# EAGLE design TXS0108 Breakout (EAGLE 9.6.2)
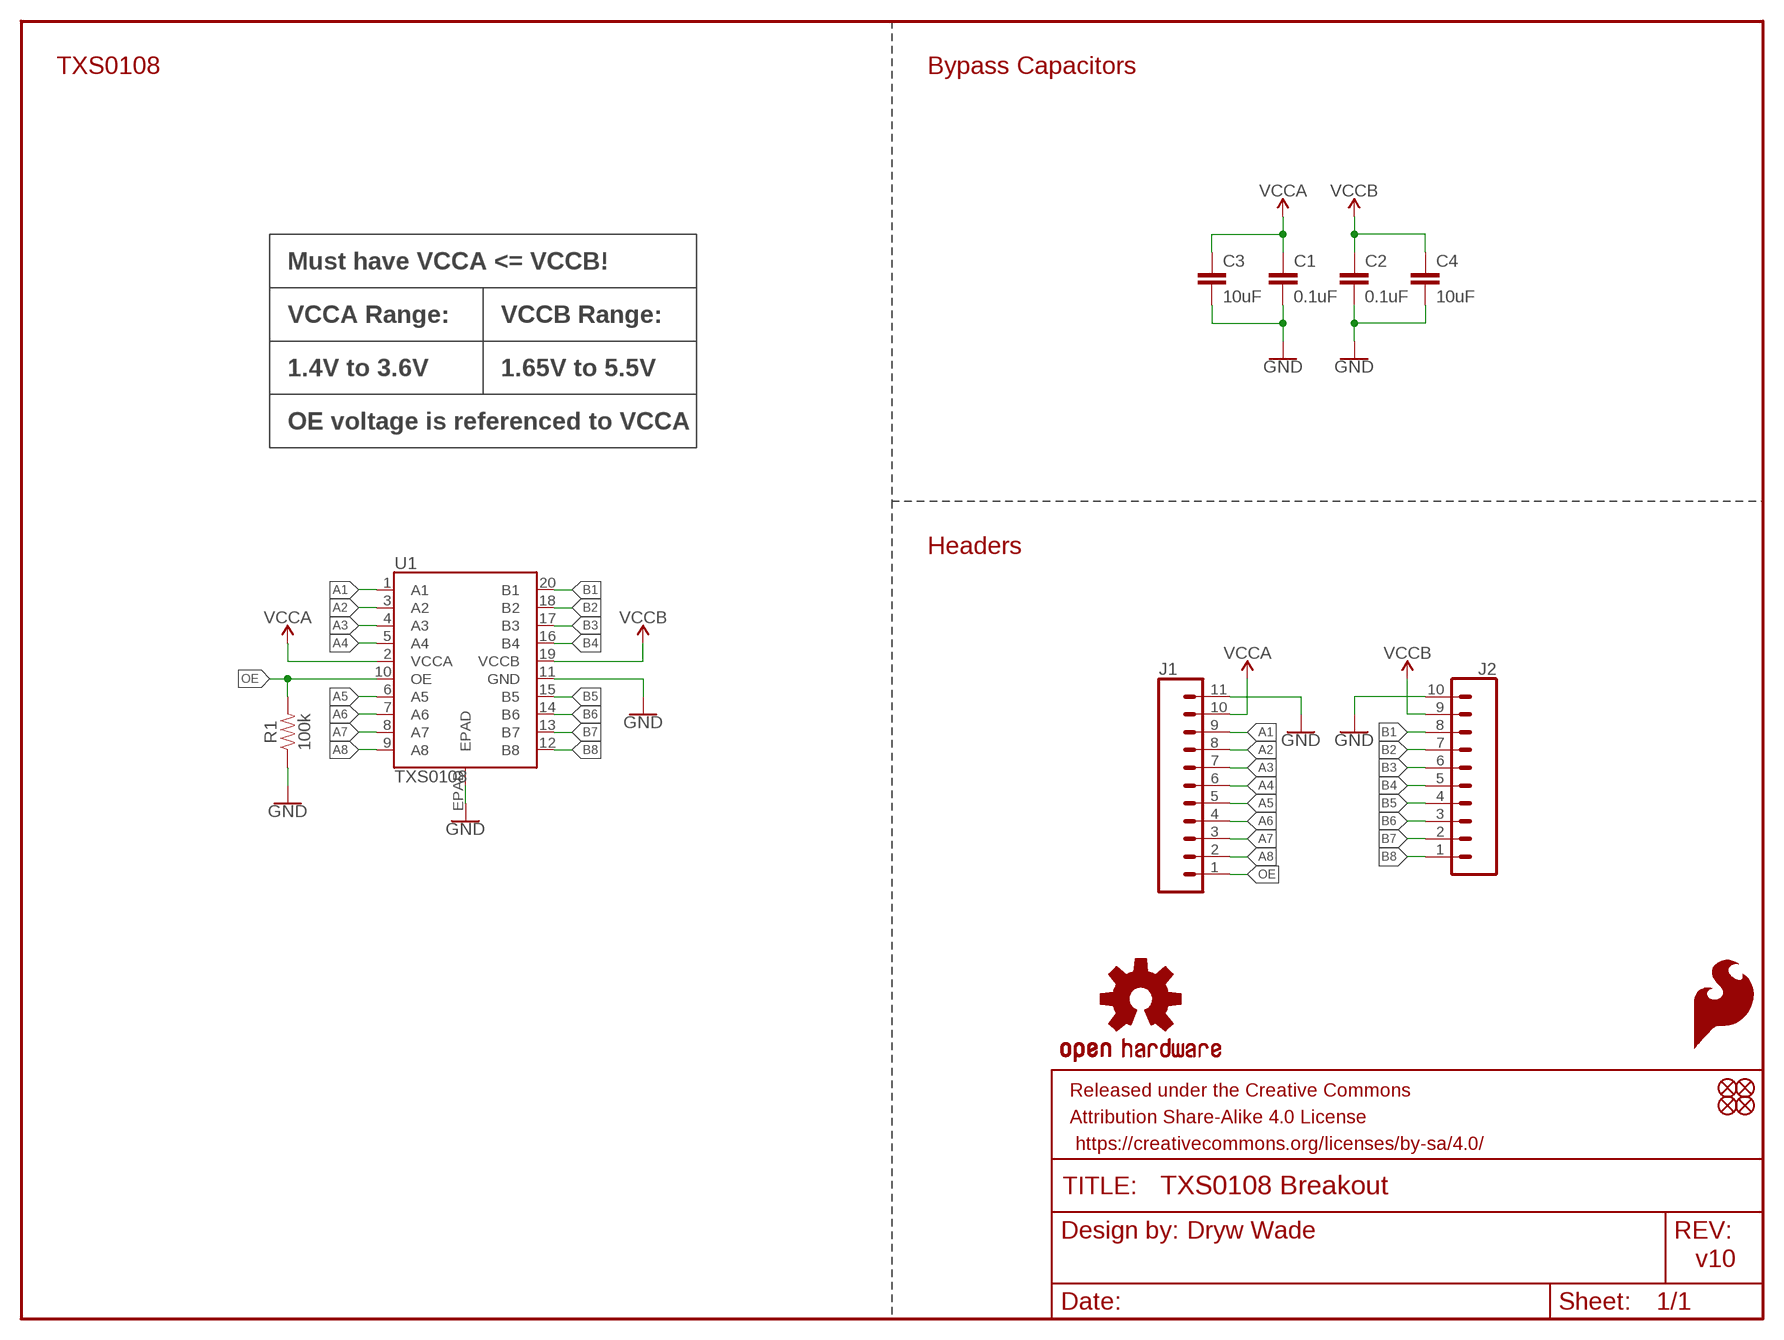
[diagram p0: schematic, sheet 1]

## Parts
C1  0.1uF  0.1UF-0603-25V-(+80/-20%)  [0603]
C2  0.1uF  0.1UF-0603-25V-(+80/-20%)  [0603]
C3  10uF  10UF-0603-6.3V-20%  [0603]
C4  10uF  10UF-0603-6.3V-20%  [0603]
FD1  FIDUCIAL1X2  [FIDUCIAL-1X2]
FD2  FIDUCIAL1X2  [FIDUCIAL-1X2]
FD3  FIDUCIAL1X2  [FIDUCIAL-1X2]
FD4  FIDUCIAL1X2  [FIDUCIAL-1X2]
FRAME1  FRAME-LETTER  [CREATIVE_COMMONS]
J1  CONN_111X11_NO_SILK  [1X11_NO_SILK]
J2  CONN_10NO_SILK_PTH_FEMALE  [1X10_NO_SILK]
LOGO1  OSHW-LOGOS  [OSHW-LOGO-S]
LOGO2  SFE_LOGO_FLAME.1_INCH  [SFE_LOGO_FLAME_.1]
R1  100k  100KOHM-0603-1/10W-1%  [0603]
U1  TXS0108  TXS0108-VFQFN_20  [VFQFN-20]

## Nets
A1: J1.9 U1.1(A1)
A2: J1.8 U1.3(A2)
A3: J1.7 U1.4(A3)
A4: J1.6 U1.5(A4)
A5: J1.5 U1.6(A5)
A6: J1.4 U1.7(A6)
A7: J1.3 U1.8(A7)
A8: J1.2 U1.9(A8)
B1: J2.8 U1.20(B1)
B2: J2.7 U1.18(B2)
B3: J2.6 U1.17(B3)
B4: J2.5 U1.16(B4)
B5: J2.4 U1.15(B5)
B6: J2.3 U1.14(B6)
B7: J2.2 U1.13(B7)
B8: J2.1 U1.12(B8)
GND: C1.2 C2.2 C3.2 C4.2 J1.11 J2.10 R1.1 U1.11(GND) U1.EPAD
OE: J1.1 R1.2 U1.10(OE)
VCCA: C1.1 C3.1 J1.10 U1.2(VCCA)
VCCB: C2.1 C4.1 J2.9 U1.19(VCCB)

## Notes on the sheet
- TXS0108 | Bypass Capacitors
- Must have VCCA <= VCCB!
- VCCA Range: | VCCB Range:
- 1.4V to 3.6V | 1.65V to 5.5V
- OE voltage is referenced to VCCA
- Headers
- Dryw Wade
- v10

## Library data of the parts
C1 C2 = SparkFun-Capacitors:0.1UF: 0.1µF ceramic capacitors A capacitor is a passive two-terminal electrical component used to store electrical energy temporarily in an electric field.; PROD_ID: CAP-00810
C3 C4 = SparkFun-Capacitors:10UF: 10.0µF ceramic capacitors A capacitor is a passive two-terminal electrical component used to store electrical energy temporarily in an electric field.; PROD_ID: CAP-11015
FD1-FD4 = SparkFun-Aesthetics:FIDUCIAL: Fiducial Alignment Points Point-of-reference for pick-and-place machines and other optical instruments.
FRAME1 = SparkFun-Aesthetics:FRAME-LETTER: Schematic Frame - Letter Standard 8.5x11 US Letter frame
J1 = SparkFun-Connectors:CONN_11: Multi connection point. Often used as Generic Header-pin footprint for 0.1 inch spaced/style header connections On any of the 0.1 inch spaced packages, you can populate with these: Break Away Headers - Straight <https://www.sparkfun.com/products/116> (PRT-00116) Break Away Male Headers - Right Angle <https://www.sparkfun.com/products/553> (PRT-00553) Female Headers <https://www.sparkfun.com/products/115> (PRT-00115) Break Away Headers - Machine Pin <https://www.sparkfun.com/products/117> (PRT-00117) Break Away Female Headers - Swiss Machine Pin <https://www.sparkfun.com/products/743> (PRT-00743) For SCREWTERMINALS and SPRING TERMINALS visit here: Screw Terimnals on SparkFun.com <https://www.sparkfun.com/search/results?term=Screw+Terminals> (5mm/3.5mm/2.54mm spacing) This device is also useful as a general connection point to wire up your design to another part of your project. Our various solder wires solder well into these plated through hole pads. Hook-Up Wire - Assortment (Stranded, 22 AWG) <https://www.sparkfun.com/products/11375> (PRT-11375) Hook-Up Wire - Assortment (Solid Core, 22 AWG) <https://www.sparkfun.com/products/11367> (PRT-11367) View the entire wire category on our website here <https://www.sparkfun.com/categories/141>
J2 = SparkFun-Connectors:CONN_10: Multi connection point. Often used as Generic Header-pin footprint for 0.1 inch spaced/style header connections On any of the 0.1 inch spaced packages, you can populate with these: Break Away Headers - Straight <https://www.sparkfun.com/products/116> (PRT-00116) Break Away Male Headers - Right Angle <https://www.sparkfun.com/products/553> (PRT-00553) Female Headers <https://www.sparkfun.com/products/115> (PRT-00115) Break Away Headers - Machine Pin <https://www.sparkfun.com/products/117> (PRT-00117) Break Away Female Headers - Swiss Machine Pin <https://www.sparkfun.com/products/743> (PRT-00743) Arduino Stackable Header - 10 Pin <https://www.sparkfun.com/products/11376> (PRT-11376) For SCREWTERMINALS and SPRING TERMINALS visit here: Screw Terimnals on SparkFun.com <https://www.sparkfun.com/search/results?term=Screw+Terminals> (5mm/3.5mm/2.54mm spacing) This device is also useful as a general connection point to wire up your design to another part of your project. Our various solder wires solder well into these plated through hole pads. Hook-Up Wire - Assortment (Stranded, 22 AWG) <https://www.sparkfun.com/products/11375> (PRT-11375) Hook-Up Wire - Assortment (Solid Core, 22 AWG) <https://www.sparkfun.com/products/11367> (PRT-11367) View the entire wire category on our website here <https://www.sparkfun.com/categories/141> Special notes: Molex polarized connector foot print use with SKU : PRT-08231 with associated crimp pins and housings. 1MM SMD Version SKU: PRT-10208 NOTES ON THE VARIANTS LOCK and LOCK_LONGPADS... This footprint was designed to help hold the alignment of a through-hole component (i.e. 6-pin header) while soldering it into place. You may notice that each hole has been shifted either up or down by 0.005 of an inch from it's more standard position (which is a perfectly straight line). This slight alteration caused the pins (the squares in the middle) to touch the edges of the holes. Because they are alternating, it causes a "brace" to hold the component in place. 0.005 has proven to be the perfect amount of "off-center" position when using our standard breakaway headers. Although looks a little odd when you look at the bare footprint, once you have a header in there, the alteration is very hard to notice. Also,if you push a header all the way into place, it is covered up entirely on the bottom side.
LOGO1 = SparkFun-Aesthetics:OSHW-LOGO: Open-Source Hardware (OSHW) Logo This logo indicates the piece of hardware it is found on incorporates a OSHW license and/or adheres to the definition of open source hardware found here: http://freedomdefined.org/OSHW
LOGO2 = SparkFun-Aesthetics:SFE_LOGO_FLAME: SparkFun Flame Logo This is the SparkFun flame logo. The logo on the schematic will always be the same size; the package variant is the height of the flame. Default layer for the logo on the board is tSilk.
R1 = SparkFun-Resistors:100KOHM: 100kΩ resistor A resistor is a passive two-terminal electrical component that implements electrical resistance as a circuit element. Resistors act to reduce current flow, and, at the same time, act to lower voltage levels within circuits. - Wikipedia; PROD_ID: RES-07828
U1 = SparkFun-IC-Comms:TXS0108: 8-Bit Bi-Directional Level Shifter For Open-Drain and Push-Pull 1.2V-3.6V (VCCA) to 1.65V-5.5V (VCCB) bi-directional level shifter with auto direction sensing. Max data rate - VCCA 1.2V: 20Mbps (50ns), VCCA 3.3V: 100Mbps (10ns) Digikey: 296-24806-2-ND (20-VFDFN) SparkFun Products Example Product (SKU); PROD_ID: IC-14343

## Board
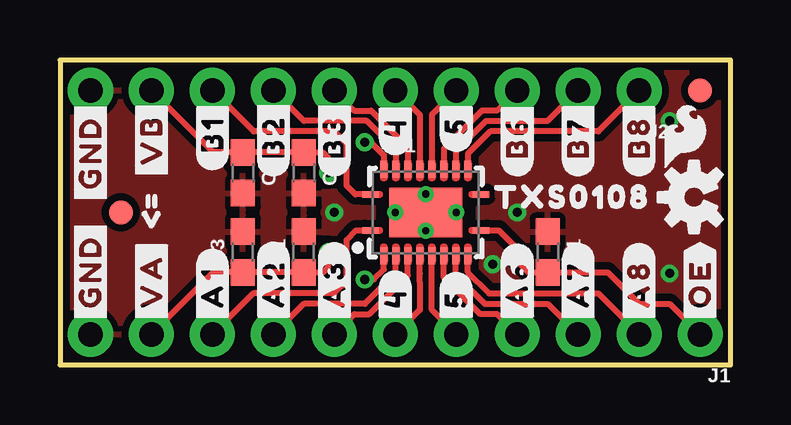
[diagram p1: board, top side]
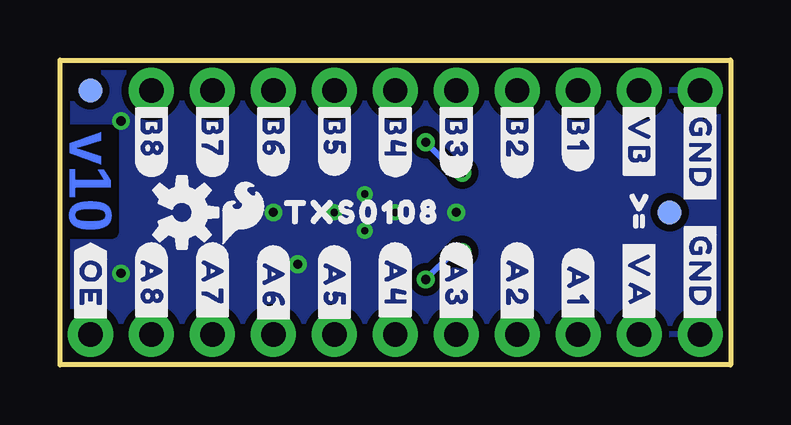
[diagram p2: board, bottom side, seen from below]

Size 27.94 x 12.7 mm. Coordinates in mm from the lower left corner, seen from the top.
Outline: 0,0 27.94,0 27.94,12.7 0,12.7 0,0
Copper layers (1*16): Top 0.035mm / dielectric 1.5mm / Bottom 0.035mm
Design rules "SparkFun-2-Layer-General-JLCPCB": minimum track width 7mil, minimum drill 0.3mm, track to track 7mil, track to pad 7mil, pad to pad 7mil, via to via 7mil, smd to smd 7mil, copper to edge 7mil, drill to drill 7mil, minimum pad ring 7mil, minimum via ring 7mil, stop-mask expansion 3mil, vias tented up to drill 25mil, thermal gap 10mil
tRestrict: area 16.9,7 to 17,7.2; area 17.3,6.9 to 17.4,6.9; area 13.5,6.1 to 13.6,6.6; area 16.9,6.1 to 17,6.6

### Footprints (pad centres in the part's own frame; a part is rotated, then mirrored left to right if it is on the bottom)
0603 = smd 1.1 x 1: 1 -0.85,0; 2 0.85,0
FIDUCIAL-1X2 = smd 1 x 1: 1 0,0
1X11_NO_SILK = drill 1.016 pad 1.88: 1 0,0; 2 2.54,0; 3 5.08,0; 4 7.62,0; 5 10.16,0; 6 12.7,0; 7 15.24,0; 8 17.78,0; 9 20.32,0; 10 22.86,0; 11 25.4,0
1X10_NO_SILK = drill 1.016 pad 1.88: 1 0,0; 2 2.54,0; 3 5.08,0; 4 7.62,0; 5 10.16,0; 6 12.7,0; 7 15.24,0; 8 17.78,0; 9 20.32,0; 10 22.86,0
VFQFN-20 = smd 0.7 x 0.28: 1 -2.3,-0.75; 10 2.3,-0.75; 11 2.3,0.75; 20 -2.3,0.75 | smd 0.28 x 0.7: 2 -1.75,-1.8; 3 -1.25,-1.8; 4 -0.75,-1.8; 5 -0.25,-1.8; 6 0.25,-1.8; 7 0.75,-1.8; 8 1.25,-1.8; 9 1.75,-1.8; 12 1.75,1.8; 13 1.25,1.8; 14 0.75,1.8; 15 0.25,1.8; 16 -0.25,1.8; 17 -0.75,1.8; 18 -1.25,1.8; 19 -1.75,1.8 | smd 3.05 x 2.05: EPAD 0,0

### Placement (x,y rotation side)
C1  10.16,4.7 90 top
C2  10.16,8 270 top
C3  7.62,4.7 90 top
C4  7.62,8 270 top
FD1  26.67,11.43 0 top
FD2  26.67,11.43 0 bottom
FD3  2.54,6.35 0 top
FD4  2.54,6.35 0 bottom
FRAME1  -11.43,-8.89 0 top  (outside the outline)
J1  26.67,1.27 180 top
J2  24.13,11.43 180 top
LOGO1  26.42,6.99 90 top
LOGO2  26.04,9.53 0 top
LOGO3  SFE_LOGO_FLAME.1_INCH  [SFE_LOGO_FLAME_.1]  20.32,6.35 0 bottom
LOGO4  OSHW-LOGOS  [OSHW-LOGO-S]  22.86,6.35 270 bottom
R1  20.32,4.7 270 top
U1  15.24,6.35 0 top
U$1  [#GND#0]  1.27,6.6 90 top
U$2  [#GND#0]  1.27,1.65 90 top
U$3  [#VA#0]  3.81,1.65 90 top
U$4  [#VA#0]  3.81,5.33 270 bottom
U$5  [#A1#0]  6.35,1.65 90 top
U$6  [#A2#0]  8.89,1.65 90 top
U$7  [#A3#0]  11.43,1.65 90 top
U$8  [#4#0]  13.97,1.65 90 top
U$9  [#5#0]  16.51,1.65 90 top
U$10  [#A6#0]  19.05,1.65 90 top
U$11  [#A7#0]  21.59,1.65 90 top
U$12  [#A8#0]  24.13,1.65 90 top
U$13  [#B8#0]  24.13,7.87 90 top
U$14  [#B7#0]  21.59,7.87 90 top
U$15  [#B6#0]  19.05,7.87 90 top
U$16  [#4#6]  13.97,8.76 90 top
U$17  [#5#6]  16.51,8.89 90 top
U$18  [#B3#0]  11.43,7.87 90 top
U$19  [#B2#0]  8.89,7.87 90 top
U$20  [#B1#0]  6.35,8.13 90 top
U$21  [#OE#0]  26.67,1.65 90 top
U$22  [#VB#0]  3.81,7.62 90 top
U$23  [#VB#0]  3.81,11.05 270 bottom
U$24  [#A1#2]  6.35,4.83 270 bottom
U$25  [#A2#2]  8.89,5.08 270 bottom
U$26  [#A3#3]  11.43,5.08 270 bottom
U$27  [#A4#4]  13.97,5.08 270 bottom
U$28  [#A5#5]  16.51,4.95 270 bottom
U$29  [#A6#6]  19.05,4.95 270 bottom
U$30  [#A7#8]  21.59,5.08 270 bottom
U$31  [#A8#9]  24.13,5.08 270 bottom
U$32  [#GND#0]  1.27,11.05 270 bottom
U$33  [#0]  3.81,6.88 90 top
U$34  [#GND#0]  1.27,6.1 270 bottom
U$35  [#B8#9]  24.13,11.05 270 bottom
U$36  [#B7#9]  21.59,11.05 270 bottom
U$37  [#B6#9]  19.05,11.05 270 bottom
U$38  [#B5#9]  16.51,11.05 270 bottom
U$39  [#B4#9]  13.97,11.05 270 bottom
U$40  [#B3#9]  11.43,11.05 270 bottom
U$41  [#B2#9]  8.89,11.05 270 bottom
U$42  [#B1#9]  6.35,11.05 270 bottom
U$43  [TXS01080]  19.3,6.35 0 bottom
U$44  [TXS01080]  17.4,6.99 0 top
U$45  [#OE#1]  26.67,5.08 270 bottom
U$46  [V0]  3.89,6.17 0 top
U$47  [#0]  3.81,6.05 90 bottom
U$48  [V0]  3.73,6.88 0 bottom

### Tracks (layer width: path | path; a pad name or v marks a point on that pad's centre or on a via)
A1
  Top 0.254: U1.1 12.33,5.6 11.94,5.21 11.94,3.48 11.43,2.97 8.05,2.97 J1.9
A2
  Top 0.254: U1.3 13.99,3.83 12.7,2.54 10.16,2.54 J1.8
A3
  Top 0.254: J1.7 12.27,2.11 12.88,2.11 14.49,3.72 U1.4
A4
  Top 0.254: U1.5 14.99,3.81 14.99,3.43 14.99,2.29 J1.6
A5
  Top 0.254: J1.5 15.49,2.29 U1.6
A6
  Top 0.254: J1.4 18.21,2.11 17.52,2.11 15.99,3.64 U1.7
A7
  Top 0.254: U1.8 16.49,3.75 17.7,2.54 20.32,2.54 J1.3
A8
  Top 0.254: U1.9 16.99,3.86 17.88,2.97 22.43,2.97 J1.2
B1
  Top 0.254: J2.8 6.37,11.43 8.07,9.73 11.43,9.73 11.94,9.22 11.94,7.47 12.3,7.1 U1.20
B2
  Top 0.254: U1.18 13.99,8.95 12.78,10.16 10.16,10.16 J2.7
B3
  Top 0.254: J2.6 12.27,10.59 12.96,10.59 14.49,9.06 U1.17
B4
  Top 0.254: J2.5 14.99,10.41 U1.16
B5
  Top 0.254: J2.4 15.49,10.41 U1.15
B6
  Top 0.254: J2.3 18.21,10.59 17.57,10.59 15.99,9.01 U1.14
B7
  Top 0.254: U1.13 16.49,8.9 17.75,10.16 20.32,10.16 J2.2
B8
  Top 0.254: U1.12 16.99,8.79 17.93,9.73 22.43,9.73 J2.1
GND  (via drill 0.3 pad 0.25, 0.38, 0.38 pad 0.25)
  other vias: 11.43,6.35 19.05,6.35 25.4,10.16 25.4,3.81 16.51,6.35 13.97,6.35 15.24,5.59 15.24,7.11 18.03,4.19
  pour Top (isolate 0.305): 0,0 27.94,0 27.94,12.7 0,12.7
  pour Bottom (isolate 0.305): 0,0 27.94,0 27.94,12.7 0,12.7
OE
  Top 0.254: U1.10 18.28,5.6 19.05,4.83 19.05,4.32 19.52,3.85 R1.2 22.82,3.85 24.13,2.54 25.4,2.54 J1.1
VCCA  (via drill 0.38)
  Top 0.254: v12.7,3.56 13.08,3.56 13.49,3.96 U1.2 | J1.10 6.39,3.85 C3.1 C1.1 10.96,3.85 11.18,4.06 v11.18,4.7
  Bottom 0.254: v11.18,4.7 11.56,4.7 v12.7,3.56
VCCB  (via drill 0.38)
  Top 0.254: v12.7,9.27 12.95,9.27 13.49,8.73 U1.19 | J2.9 6.39,8.85 C4.1 C2.1 10.96,8.85 11.18,8.64 v11.18,8
  Bottom 0.254: v11.18,8 11.43,8 v12.7,9.27

### Text on the board
Bottom: v10
Measures: Units: inches
tDocu: Dryw Wade